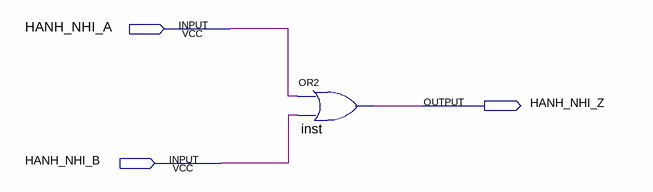
[diagram p0: schematic sheet]
// Quartus schematic Assignment3b.bdf as structural Verilog: 1 symbols, 3 pins
module Assignment3b (
  input  HANH_NHI_A,
  input  HANH_NHI_B,
  output HANH_NHI_Z
);

  or inst (HANH_NHI_Z, HANH_NHI_A, HANH_NHI_B);
endmodule
